# Altium schematic sheet cm108 schematic_2022-07-07.schdoc
size 295 x 176 mm
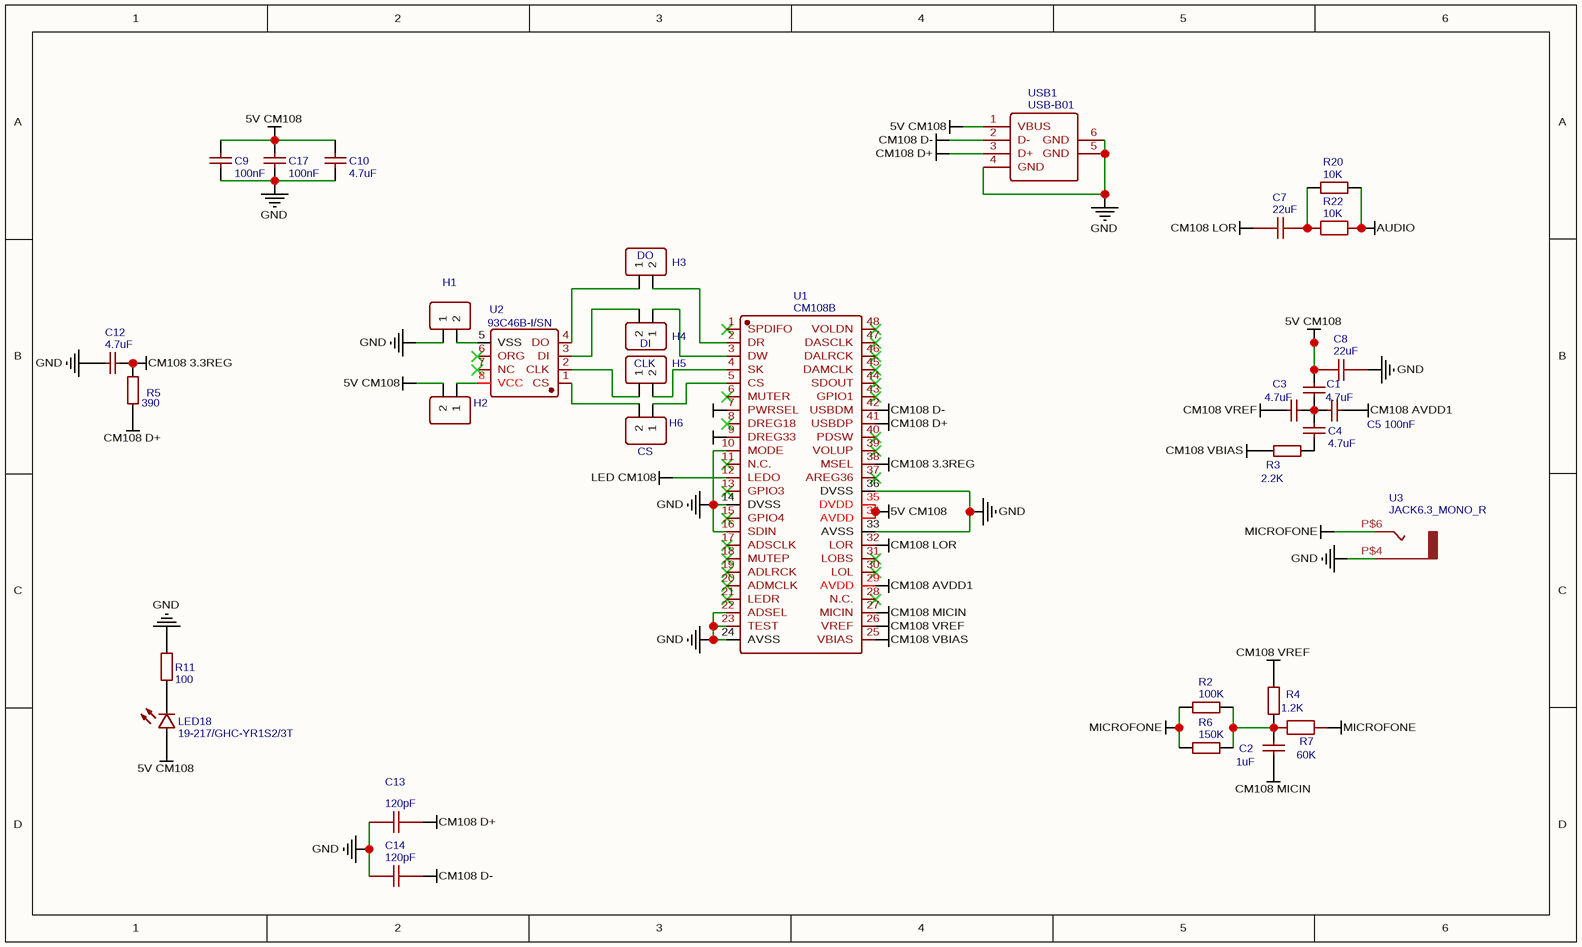
[diagram p0: cm108 schematic_2022-07-07.schdoc]

## Parts
C1  4.7uF  [C0805]
C2  1uF  [C0805]
C3  4.7uF  [C0805]
C4  4.7uF  [C0805]
C5  100nF  [C0805]
C7  22uF  [C0805]
C8  22uF  [C0805]
C9  100nF  [C0805]
C10  4.7uF  [C0805]
C12  4.7uF  [C0805]
C13  120pF  [C0805]
C14  120pF  [C0805]
C17  100nF  [C0805]
H1  HDR-F-2.54_1x2  [HDR-F-2.54_1X2]  (value not drawn)
H2  HDR-F-2.54_1x2  [HDR-F-2.54_1X2]  (value not drawn)
H3  DO  [HDR-F-2.54_1X2]
H4  DI  [HDR-F-2.54_1X2]
H5  CLK  [HDR-F-2.54_1X2]
H6  CS  [HDR-F-2.54_1X2]
LED18  19-217/GHC-YR1S2/3T  [LED0603-R-RD]
R2  100K  [R0603]
R3  2.2K  [R0805]
R4  1.2K  [R0805]
R5  390  [R1206]
R6  150K  [R0603]
R7  60K  [RES-TH_BD2.4-L6.3-P10.30-D0.6]
R11  100  [R0805]
R20  10K  [R0603]
R22  10K  [RES-TH_BD2.4-L6.3-P10.30-D0.6]
U1  CM108B  [LQFP-48_L7.0-W7.0-P0.50-LS9.0-BL]
U2  93C46B-I/SN  [SOIC-8_L5.0-W4.0-P1.27-LS6.0-BL]
U3  JACK6.3_MONO_R  [JACK6.3]
USB1  USB-B01  [USB-B-TH_USB-B01]

## Nets
5V CM108: C1.1 C8.1 C9.2 C10.2 C17.2 H2.2 LED18.1(A) U1.34(AVDD) U1.35(DVDD) USB1.1(VBUS)
AUDIO: R20.1 R22.1
CM108 3.3REG: C12.2 R5.2 U1.7(PWRSEL) U1.9(DREG33) U1.38(MSEL)
CM108 AVDD1: C5.2 U1.29(AVDD)
CM108 D+: C13.1 R5.1 U1.41(USBDP) USB1.3(D+)
CM108 D-: C14.1 U1.42(USBDM) USB1.2(D-)
CM108 LOR: C7.1 U1.32(LOR)
CM108 MICIN: C2.1 U1.27(MICIN)
CM108 VBIAS: R3.2 U1.25(VBIAS)
CM108 VREF: C3.2 R4.2 U1.26(VREF)
GND: C8.2 C9.1 C10.1 C12.1 C13.2 C14.2 C17.1 H1.1 R11.2 U1.10(MODE) U1.14(DVSS) U1.16(SDIN) U1.22(ADSEL) U1.23(TEST) U1.24(AVSS) U1.33(AVSS) U1.36(DVSS) U3.P$4 USB1.4(GND) USB1.5(GND) USB1.6(GND)
LED CM108: U1.12(LEDO)
MICROFONE: R2.2 R6.2 R7.2 U3.P$6
NetC1_2: C1.2 C3.1 C4.1 C5.1
NetC2_2: C2.2 R2.1 R4.1 R6.1 R7.1
NetC4_2: C4.2 R3.1
NetC7_2: C7.2 R20.2 R22.2
NetH1_2: H1.2 U2.5(VSS)
NetH2_1: H2.1 U2.8(VCC)
NetH3_1: H3.1 U2.4(DO)
NetH3_2: H3.2 U1.2(DR)
NetH4_1: H4.1 U1.3(DW)
NetH4_2: H4.2 U2.3(DI)
NetH5_1: H5.1 U2.2(CLK)
NetH5_2: H5.2 U1.4(SK)
NetH6_1: H6.1 U1.5(CS)
NetH6_2: H6.2 U2.1(CS)
NetLED18_2: LED18.2(C) R11.1

Not connected (* = marked no-connect by the designer): U1 1(SPDIFO)* 6(MUTER)* 8(DREG18)* 11(N.C.)* 13(GPIO3)* 15(GPIO4)* 17(ADSCLK)* 18(MUTEP)* 19(ADLRCK)* 20(ADMCLK)* 21(LEDR)* 28(N.C.)* 30(LOL)* 31(LOBS)* 37(AREG36)* 39(VOLUP)* 40(PDSW)* 43(GPIO1)* 44(SDOUT)* 45(DAMCLK)* 46(DALRCK)* 47(DASCLK)* 48(VOLDN)*; U2 6(ORG)* 7(NC)*

## Library data of the parts
C1 C3 C4 C10 C12 = 4.7uF: BOM_Manufacturer Part: CL21A475KAQNNNE; BOM_Manufacturer: SAMSUNG; nameAlias: Capacitance; SMT Type: Basic; BOM_Supplier: LCSC; BOM_LCSC Assembly: Yes; BOM_Supplier Part: C1779; spicePre: C; spiceSymbolName: CL21A475KAQNNNE
C2 = 1uF: BOM_Manufacturer Part: CL21B105KBFNNNE; BOM_Manufacturer: SAMSUNG; nameAlias: Capacitance; SMT Type: Basic; BOM_Supplier: LCSC; BOM_LCSC Assembly: Yes; BOM_Supplier Part: C28323; spicePre: C; spiceSymbolName: CL21B105KBFNNNE
C5 C9 C17 = 100nF: BOM_Manufacturer Part: CC0805KRX7R9BB104; BOM_Manufacturer: YAGEO; nameAlias: Capacitance; SMT Type: Basic; BOM_Supplier: LCSC; BOM_Supplier Part: C49678; BOM_JLCPCB SMD: Yes; spicePre: C; spiceSymbolName: CC0805KRX7R9BB104
C7 C8 = 22uF: BOM_Manufacturer: SAMSUNG; BOM_Manufacturer Part: CL21A226MAQNNNE; nameAlias: Capacitance; SMT Type: Basic; BOM_Supplier: LCSC; BOM_Supplier Part: C45783; BOM_JLCPCB SMD: Yes; spicePre: C; spiceSymbolName: CL21A226MAQNNNE
C13 C14 = 120pF: BOM_Manufacturer: Samsung Electro-Mechanics; BOM_Manufacturer Part: CL21C121JBANNNC; nameAlias: Capacitance; Contributor: LCSC; SMT Type: Extend; BOM_Supplier: LCSC; BOM_Supplier Part: C159770; BOM_LCSC Assembly: Yes; spicePre: C; spiceSymbolName: CL21C121JBANNNC
H1 H2 = HDR-F-2.54_1x2: Contributor: LCEDA_Lib; BOM_Supplier Part: C49661; BOM_Supplier: LCSC; spicePre: H; spiceSymbolName: HDR-F-2.54_1x2
H3 = DO: Contributor: LCEDA_Lib; BOM_Supplier Part: C49661; BOM_Supplier: LCSC; spicePre: H; spiceSymbolName: HDR-F-2.54_1x2
H4 = DI: Contributor: LCEDA_Lib; BOM_Supplier Part: C49661; BOM_Supplier: LCSC; spicePre: H; spiceSymbolName: HDR-F-2.54_1x2
H5 = CLK: Contributor: LCEDA_Lib; BOM_Supplier Part: C49661; BOM_Supplier: LCSC; spicePre: H; spiceSymbolName: HDR-F-2.54_1x2
H6 = CS: Contributor: LCEDA_Lib; BOM_Supplier Part: C49661; BOM_Supplier: LCSC; spicePre: H; spiceSymbolName: HDR-F-2.54_1x2
LED18 = 19-217/GHC-YR1S2/3T: BOM_Manufacturer: EVERLIGHT; SMT Type: Basic; BOM_Supplier: LCSC; BOM_Manufacturer Part: 19-217/GHC-YR1S2/3T; BOM_LCSC Assembly: Yes; image: //image.lceda.cn/szlcsc/C72043.jpg; BOM_Supplier Part: C72043; spicePre: L; spiceSymbolName: 19-217/GHC-YR1S2/3T
R2 = 100K: BOM_Manufacturer: UniOhm; BOM_Manufacturer Part: 0603WAF1003T5E; nameAlias: Resistance (Ohms); SMT Type: Basic; BOM_Supplier: LCSC; BOM_Supplier Part: C25803; BOM_JLCPCB SMD: Yes; spicePre: R; spiceSymbolName: 0603WAF1003T5E
R3 = 2.2K: BOM_Manufacturer: UniOhm; BOM_Manufacturer Part: 0805W8F2201T5E; nameAlias: Resistance (Ohms); SMT Type: Basic; BOM_Supplier: LCSC; BOM_LCSC Assembly: Yes; BOM_Supplier Part: C17520; spicePre: R; spiceSymbolName: 0805W8F2201T5E
R4 = 1.2K: BOM_Manufacturer: UniOhm; BOM_Manufacturer Part: 0805W8F1201T5E; nameAlias: Resistance (Ohms); SMT Type: Basic; BOM_Supplier: LCSC; BOM_LCSC Assembly: Yes; BOM_Supplier Part: C17379; spicePre: R; spiceSymbolName: 0805W8F1201T5E
R5 = 390: BOM_Manufacturer: UniOhm; BOM_Manufacturer Part: 1206W4J0391T5E; nameAlias: Resistance (Ohms); SMT Type: Extend; BOM_Supplier: LCSC; BOM_Supplier Part: C25378; BOM_LCSC Assembly: Yes; spicePre: R; spiceSymbolName: 1206W4J0391T5E
R6 = 150K: BOM_Manufacturer: UniOhm; BOM_Manufacturer Part: 0603WAF1503T5E; nameAlias: Resistance (Ohms); SMT Type: Basic; BOM_Supplier: LCSC; BOM_Supplier Part: C22807; BOM_JLCPCB SMD: Yes; spicePre: R; spiceSymbolName: 0603WAF1503T5E
R7 = 60K: BOM_Manufacturer: TyoHM; BOM_Manufacturer Part: RN 1/4W 10K F T/B A1; nameAlias: Resistance (Ohms); Contributor: LCSC; BOM_Supplier: LCSC; BOM_Supplier Part: C410695; spicePre: R; spiceSymbolName: RN 1/4W 10K F T/B A1
R11 = 100: BOM_Manufacturer: UniOhm; BOM_Manufacturer Part: 0805W8F1000T5E; nameAlias: Resistance (Ohms); SMT Type: Basic; BOM_Supplier: LCSC; BOM_Supplier Part: C17408; BOM_JLCPCB SMD: Yes; spicePre: R; spiceSymbolName: 0805W8F1000T5E
R20 = 10K: BOM_Manufacturer: UniOhm; BOM_Manufacturer Part: 0603WAF1002T5E; nameAlias: Resistance (Ohms); SMT Type: Basic; BOM_Supplier: LCSC; BOM_LCSC Assembly: Yes; BOM_Supplier Part: C25804; spicePre: R; spiceSymbolName: 0603WAF1002T5E
R22 = 10K: BOM_Manufacturer: TyoHM; BOM_Manufacturer Part: RN 1/4W 10K F T/B A1; nameAlias: Resistance (Ohms); Contributor: LCSC; BOM_Supplier: LCSC; BOM_Supplier Part: C410695; spicePre: R; spiceSymbolName: RN 1/4W 10K F T/B A1
U1 = CM108B: BOM_Manufacturer: Cmedia; Contributor: LCSC; SMT Type: Extend; BOM_Supplier: LCSC; BOM_Supplier Part: C371347; BOM_Manufacturer Part: CM108B; BOM_JLCPCB SMD: Yes; spicePre: U; spiceSymbolName: CM108B
U2 = 93C46B-I/SN: BOM_Manufacturer: Microchip Tech; Contributor: LCSC; BOM_Supplier: LCSC; BOM_Supplier Part: C615354; BOM_Manufacturer Part: 93C46B-I/SN; BOM_JLCPCB Part Class: Extended Part; spicePre: U; spiceSymbolName: 93C46B-I/SN
USB1 = USB-B01: BOM_Manufacturer: SOFNG; Contributor: LCSC; BOM_Supplier: LCSC; BOM_Supplier Part: C498173; BOM_Manufacturer Part: USB-B01; BOM_JLCPCB Part Class: Extended Part; spicePre: U; spiceSymbolName: USB-B01
U3 = JACK6.3_MONO_R: spicePre: U; spiceSymbolName: JACK6.3_MONO_R